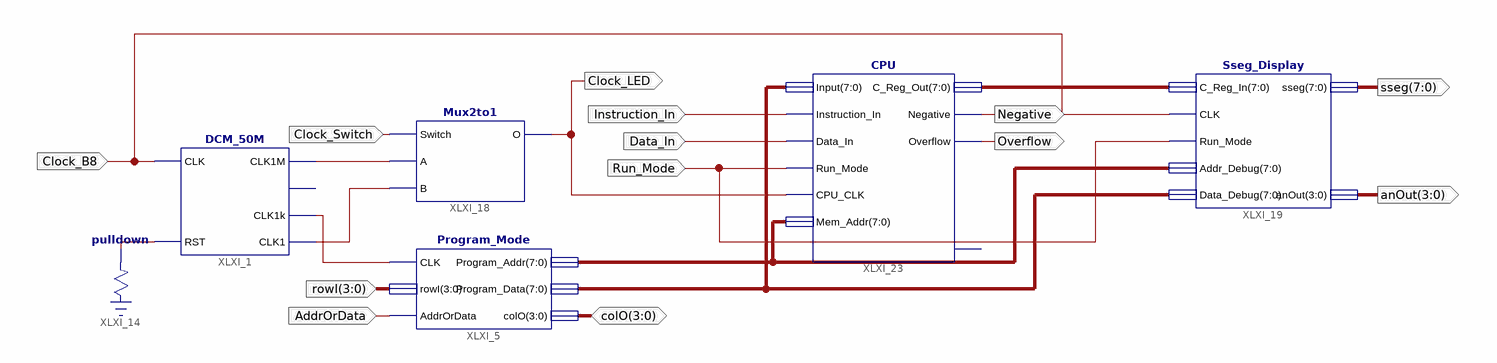
[diagram p0: schematic sheet 1]
// Xilinx ISE schematic FinalComputer.sch (spartan3e) as structural Verilog: 6 symbols, 13 ports
module FinalComputer (
  input  Clock_Switch,
  input  [3:0] rowI,
  input  AddrOrData,
  input  Instruction_In,
  input  Data_In,
  input  Clock_B8,
  input  Run_Mode,
  inout  [3:0] colO,
  output Clock_LED,
  output [7:0] sseg,
  output [3:0] anOut,
  output Negative,
  output Overflow
);

  wire XLXN_105, XLXN_142, XLXN_171, XLXN_184;
  wire [7:0] XLXN_173, XLXN_175, XLXN_176;

  DCM_50M XLXI_1 (.CLK(Clock_B8), .RST(XLXN_184), .CLK1M(XLXN_142), .CLK1k(XLXN_105), .CLK1(XLXN_171));  // open: CLK10k
  Mux2to1 XLXI_18 (.Switch(Clock_Switch), .A(XLXN_142), .B(XLXN_171), .O(Clock_LED));
  \pulldown  XLXI_14 (.O(XLXN_184));
  Program_Mode XLXI_5 (
    .Program_Addr(XLXN_175), .Program_Data(XLXN_173), .colO(colO), .CLK(XLXN_105), .AddrOrData(AddrOrData),
    .rowI(rowI));
  Sseg_Display XLXI_19 (
    .C_Reg_In(XLXN_176), .CLK(Clock_B8), .Run_Mode(Run_Mode), .Data_Debug(XLXN_173), .Addr_Debug(XLXN_175),
    .anOut(anOut), .sseg(sseg));
  CPU XLXI_23 (
    .Input(XLXN_173), .Instruction_In(Instruction_In), .Data_In(Data_In), .Mem_Addr(XLXN_175),
    .Run_Mode(Run_Mode), .CPU_CLK(Clock_LED), .C_Reg_Out(XLXN_176), .Overflow(Overflow), .Negative(Negative));  // open: XLXN_1065
endmodule
